# EAGLE design PCB_3_POGOS (EAGLE 9.6.2)
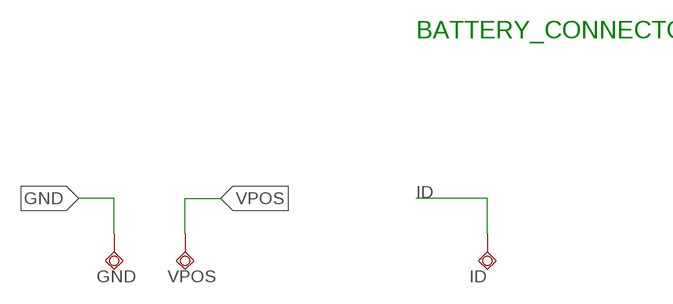
[diagram p0: schematic, sheet 1]

## Parts
GND  TESTPAD_TPSQB1,27  [TESTPAD_B1,27]
ID  TESTPAD_TPSQB1,27  [TESTPAD_B1,27]
VPOS  TESTPAD_TPSQB1,27  [TESTPAD_B1,27]

## Nets
GND: GND.TP
ID: ID.TP
VPOS: VPOS.TP

## Notes on the sheet
- BATTERY_CONNECTOR

## Library data of the parts
GND ID VPOS = BeagleBone_Blue_R3:TESTPAD_TPSQ: Test pad

## Board
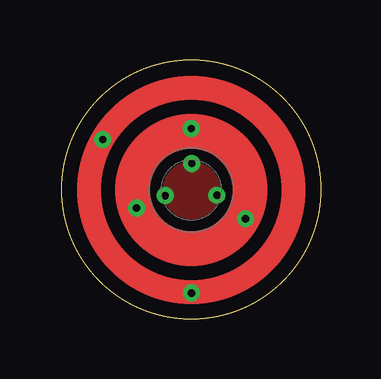
[diagram p1: board, top side]
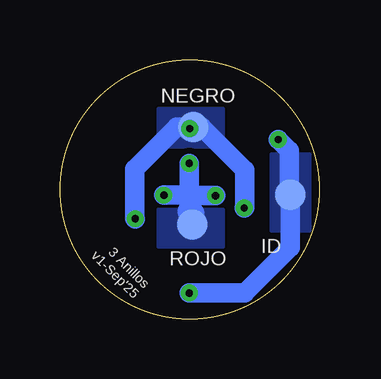
[diagram p2: board, bottom side, seen from below]

Size 10.8 x 10.8 mm. Coordinates in mm from the lower left corner, seen from the top.
Outline: circle at 5.4,5.4 radius 5.4
Copper layers (1+2*15+16): Top 0.035mm / dielectric 1.5mm / Route2 0.035mm / dielectric 0.15mm / Route15 0.035mm / dielectric 0.2mm / Bottom 0.035mm
Design rules "default *": minimum track width 0.00038125mm, minimum drill 0.3mm, track to track 10mil, track to pad 10mil, pad to pad 10mil, via to via 10mil, smd to smd 0mil, copper to edge 0mil, drill to drill 6mil, minimum pad ring 10mil, minimum via ring 8mil, stop-mask expansion 0mil, vias tented up to drill 50mil, thermal gap 0mil

### Footprints (pad centres in the part's own frame; a part is rotated, then mirrored left to right if it is on the bottom)
TESTPAD_B1,27 = smd 1.27 x 1.27: TP 0,0

### Placement (x,y rotation side)
GND  5.24,7.99 0 bottom
ID  1.2,5.17 0 bottom
VPOS  5.29,3.93 0 bottom

### Tracks (layer width: path | path; a pad name or v marks a point on that pad's centre or on a via)
GND  (via drill 0.3)
  Bottom 0.813: v3.12,4.62 3.1,4.64 3.1,6.21 4.89,7.99 GND.TP 5.34,7.99 5.93,7.99 7.68,6.25 7.68,4.2 v7.66,4.17
  Bottom 1.016: 5.34,7.99 v5.4,7.94
  pour Bottom: 4,8.78 6.7,8.78 6.7,7.18 4,7.18
ID  (via drill 0.3)
  Bottom 0.813: v1.71,7.47 1.25,7.02 1.25,5.22 ID.TP 1.2,2.97 3.1,1.08 v5.41,1.08
  pour Bottom (isolate 0.254): 0.4,3.67 0.4,6.88 2,6.88 2,3.67
VPOS  (via drill 0.3)
  Bottom 0.813: 5.39,5.37 5.16,5.13 v4.32,5.13 | 5.39,5.16 v6.47,5.16 | 5.39,4.49 5.39,5.16 | 5.39,5.16 5.39,5.37 | v5.42,6.48 5.42,5.39 5.39,5.37
  Bottom 1.016: VPOS.TP 5.29,4.38 5.39,4.49
  pour Bottom: 4,4.55 6.7,4.55 6.7,3 4,3
  pour Top (isolate 0.5): 6.66,5.37 arc180 4.16,5.37 arc180
(copper drawn outside any net)
  shapes: Top circle x2

### Text on the board
bPlace: NEGRO | ROJO | 3 Anillos / v1-Sep'25